# Altium schematic sheet Menu-Control-Motor.SchDoc
size A4; SheetNumber: 1; SheetTotal: 2
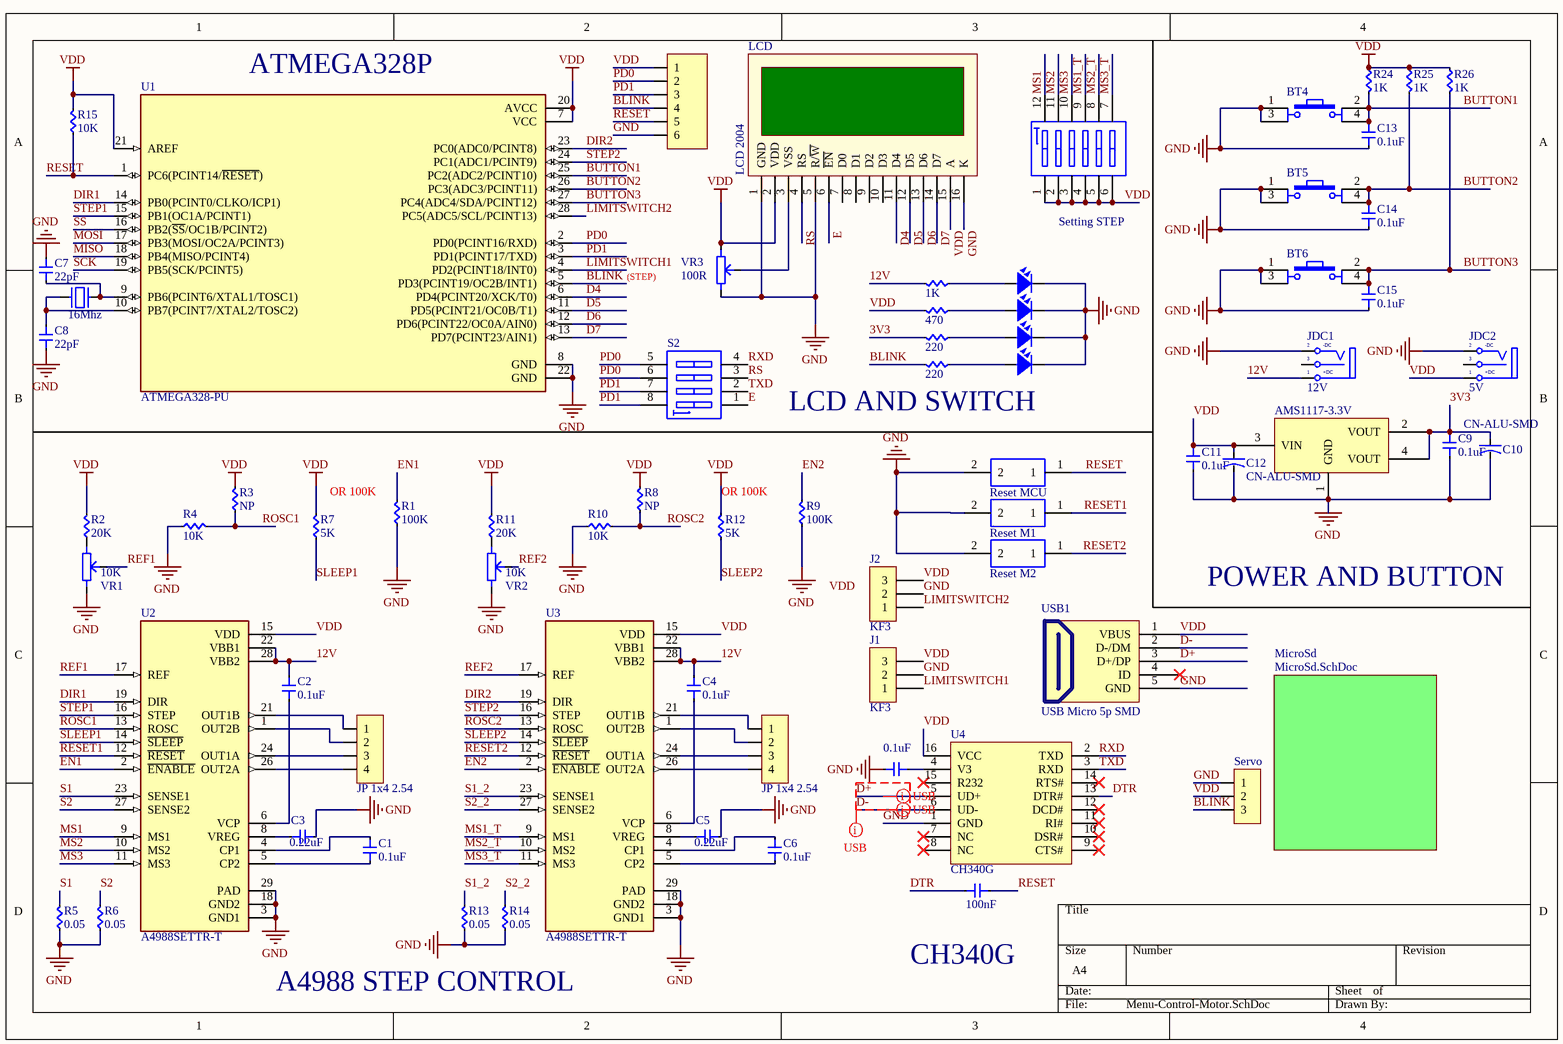
[diagram p0: Menu-Control-Motor.SchDoc]

## Parts
AMS1117-3.3V  AMS1117-3.3V  [SOT223]  (value not drawn)
BT4  Button 4p  [SMD button 4 pins 6x6]  (value not drawn)
BT5  Button 4p  [SMD button 4 pins 6x6]  (value not drawn)
BT6  Button 4p  [SMD button 4 pins 6x6]  (value not drawn)
C1  0.1uF  [Cap 0805]
C2  0.1uF  [Cap 0805]
C3  0.22uF  [Cap 0805]
C4  0.1uF  [Cap 0805]
C5  0.22uF  [Cap 0805]
C6  0.1uF  [Cap 0805]
C7  22pF  [Cap 0805]
C8  22pF  [Cap 0805]
C9  0.1uF  [Cap 0805]
C10  CN-ALU-SMD  [CAP-ALU-SMD-6.3x7.7x2.2]
C11  0.1uF  [Cap 0805]
C12  CN-ALU-SMD  [CAP-ALU-SMD-6.3x7.7x2.2]
C13  0.1uF  [Cap 0805]
C14  0.1uF  [Cap 0805]
C15  0.1uF  [Cap 0805]
C16  0.1uF  [Cap 0805]
C17  100nF  [Cap 0805]
DEBUG  CHECK  [JP 1x6 DT]  (value not drawn)
J1  KF3  [KF3-5.08]
J2  KF3  [KF3-5.08]
JDC1  12V  [DC0]
JDC2  5V  [DC0]
JP2  JP 1x4 2.54  [JP 1x4 DT]
JP3  JP 1x4 2.54  [JP 1x4 DT]
LCD  LCD 2004  [LCD_LCD-20X4B]
LED1  LED  [LED-0805-Blue]  (value not drawn)
LED2  LED  [LED-0805-Blue]  (value not drawn)
LED3  LED  [LED-0805-Blue]  (value not drawn)
LED4  LED  [LED-0805-Blue]  (value not drawn)
R1  100K  [RES 0805]
R2  20K  [RES 0805]
R3  NP  [RES 0805]
R4  10K  [RES 0805]
R5  0.05  [RES 0805]
R6  0.05  [RES 0805]
R7  5K  [RES 0805]
R8  NP  [RES 0805]
R9  100K  [RES 0805]
R10  10K  [RES 0805]
R11  20K  [RES 0805]
R12  5K  [RES 0805]
R13  0.05  [RES 0805]
R14  0.05  [RES 0805]
R15  10K  [RES 0805]
R16  1K  [RES 0805]
R17  470  [RES 0805]
R21  220  [RES 0805]
R24  1K  [RES 0805]
R25  1K  [RES 0805]
R26  1K  [RES 0805]
R27  220  [RES 0805]
Reset_M1  Component_1  [PCBComponent_1]  (value not drawn)
Reset_M2  Component_1  [PCBComponent_1]  (value not drawn)
Reset_MCU  Component_1  [PCBComponent_1]  (value not drawn)
S2  (no value)  [SW-DIP4]
Servo  JP 1x3 2.54  [JP 1x3 DT]  (value not drawn)
Setting_STEP  (no value)  [SW-DIP6]
U1  ATMEGA328-PU  [DIP787W46P254L3467H508Q28]
U2  A4988SETTR-T  [QFN50P500X500X90-29N]
U3  A4988SETTR-T  [QFN50P500X500X90-29N]
U4  CH340G  [SOIC16_50_284_25X90_SMT]
USB1  USB Micro 5p SMD  [USB Micro 5p SMD]
VR1  10K  [Bien Tro Tam Giac Dung]
VR2  10K  [Bien Tro Tam Giac Dung]
VR3  100R  [Bien Tro Tam Giac Dung]
Y1  16Mhz  [Thach Anh 2 chan cam]

## Sub-sheets
MicroSd = MicroSd.SchDoc: no entries

## Nets
GND: AMS1117-3.3V.1(GND) BT4.1 BT4.3 BT5.1 BT5.3 BT6.1 BT6.3 C3.2 C5.2 C7.2 C8.1 C9.2 C10.2 C11.2 C12.2 C13.2 C14.2 C15.2 C16.1 DEBUG.6 J1.2 J2.2 JDC1.2(TN) JDC2.2(TN) LCD.1(GND) LCD.5(R/~{W}) LCD.16(K) LED1.2 LED2.2 LED3.2 LED4.2 R1.1 R4.1 R5.1 R6.1 R9.1 R10.1 R13.1 R14.1 Reset_M1.2 Reset_M2.2 Reset_MCU.2 Servo.1 U1.8(GND) U1.22(GND) U2.3(GND1) U2.18(GND2) U2.29(PAD) U3.3(GND1) U3.18(GND2) U3.29(PAD) U4.1(GND) USB1.5(GND) VR1.3 VR2.3 VR3.3
VDD: AMS1117-3.3V.3(VIN) C11.1 C12.1 DEBUG.1 J1.3 J2.3 JDC2.1(T) LCD.2(VDD) LCD.15(A) R2.2 R3.2 R7.2 R8.2 R11.2 R12.2 R15.2 R17.2 R24.1 R25.1 R26.1 Servo.2 Setting_STEP.1 Setting_STEP.2 Setting_STEP.3 Setting_STEP.4 Setting_STEP.5 Setting_STEP.6 U1.7(VCC) U1.20(AVCC) U1.21(AREF) U2.15(VDD) U3.15(VDD) U4.16(VCC) USB1.1(VBUS) VR3.1
3V3: AMS1117-3.3V.2(VOUT) AMS1117-3.3V.4(VOUT) C9.1 C10.1 R21.2
12V: C2.1 C4.1 JDC1.1(T) R16.2 U2.22(VBB1) U2.28(VBB2) U3.22(VBB1) U3.28(VBB2)
BLINK: DEBUG.4 R27.2 Servo.3 U1.5(PD3(PCINT19/OC2B/INT1))
BUTTON1: BT4.2 BT4.4 C13.1 R24.2 U1.25(PC2(ADC2/PCINT10))
BUTTON2: BT5.2 BT5.4 C14.1 R25.2 U1.26(PC3(ADC3/PCINT11))
BUTTON3: BT6.2 BT6.4 C15.1 R26.2 U1.27(PC4(ADC4/SDA/PCINT12))
D4: LCD.11(D4) U1.6(PD4(PCINT20/XCK/T0))
D5: LCD.12(D5) U1.11(PD5(PCINT21/OC0B/T1))
D6: LCD.13(D6) U1.12(PD6(PCINT22/OC0A/AIN0))
D7: LCD.14(D7) U1.13(PD7(PCINT23/AIN1))
D+: U4.5(UD+) USB1.3(D+/DP)
D-: U4.6(UD-) USB1.2(D-/DM)
DIR1: U1.14(PB0(PCINT0/CLKO/ICP1)) U2.19(DIR)
DIR2: U1.23(PC0(ADC0/PCINT8)) U3.19(DIR)
DTR: C17.1 U4.13(DTR#)
E: LCD.6(~{EN}) S2.1
EN1: R1.2 U2.2(~{ENABLE})
EN2: R9.2 U3.2(~{ENABLE})
LIMITSWITCH1: J1.1 U1.4(PD2(PCINT18/INT0))
LIMITSWITCH2: J2.1 U1.28(PC5(ADC5/SCL/PCINT13))
MISO: U1.18(PB4(MISO/PCINT4))
MOSI: U1.17(PB3(MOSI/OC2A/PCINT3))
MS1: Setting_STEP.12 U2.9(MS1)
MS1_T: Setting_STEP.9 U3.9(MS1)
MS2: Setting_STEP.11 U2.10(MS2)
MS2_T: Setting_STEP.8 U3.10(MS2)
MS3: Setting_STEP.10 U2.11(MS3)
MS3_T: Setting_STEP.7 U3.11(MS3)
PD0: DEBUG.2 S2.5 S2.6 U1.2(PD0(PCINT16/RXD))
PD1: DEBUG.3 S2.7 S2.8 U1.3(PD1(PCINT17/TXD))
REF1: U2.17(REF) VR1.2
REF2: U3.17(REF) VR2.2
RESET: C17.2 DEBUG.5 R15.1 Reset_MCU.1 U1.1(PC6(PCINT14/~{RESET}))
RESET1: Reset_M1.1 U2.12(~{RESET})
RESET2: Reset_M2.1 U3.12(~{RESET})
ROSC1: R3.1 R4.2 U2.13(ROSC)
ROSC2: R8.1 R10.2 U3.13(ROSC)
RS: LCD.4(RS) S2.3
RXD: S2.4 U4.2(TXD)
S1: R5.2 U2.23(SENSE1)
S1_2: R13.2 U3.23(SENSE1)
S2: R6.2 U2.27(SENSE2)
S2_2: R14.2 U3.27(SENSE2)
SCK: U1.19(PB5(SCK/PCINT5))
SLEEP1: R7.1 U2.14(~{SLEEP})
SLEEP2: R12.1 U3.14(~{SLEEP})
SS: U1.16(PB2(~{SS}/OC1B/PCINT2))
STEP1: U1.15(PB1(OC1A/PCINT1)) U2.16(STEP)
STEP2: U1.24(PC1(ADC1/PCINT9)) U3.16(STEP)
TXD: S2.2 U4.3(RXD)
NetC1_1: C1.1 U2.4(CP1)
NetC1_2: C1.2 U2.5(CP2)
NetC2_2: C2.2 U2.6(VCP)
NetC3_1: C3.1 U2.8(VREG)
NetC4_2: C4.2 U3.6(VCP)
NetC5_1: C5.1 U3.8(VREG)
NetC6_1: C6.1 U3.4(CP1)
NetC6_2: C6.2 U3.5(CP2)
NetC7_1: C7.1 U1.9(PB6(PCINT6/XTAL1/TOSC1)) Y1.2
NetC8_2: C8.2 U1.10(PB7(PCINT7/XTAL2/TOSC2)) Y1.1
NetC16_2: C16.2 U4.4(V3)
NetJP2_1: JP2.1 U2.21(OUT1B)
NetJP2_2: JP2.2 U2.1(OUT2B)
NetJP2_3: JP2.3 U2.24(OUT1A)
NetJP2_4: JP2.4 U2.26(OUT2A)
NetJP3_1: JP3.1 U3.21(OUT1B)
NetJP3_2: JP3.2 U3.1(OUT2B)
NetJP3_3: JP3.3 U3.24(OUT1A)
NetJP3_4: JP3.4 U3.26(OUT2A)
NetLCD_3: LCD.3(VSS) VR3.2
NetLED1_1: LED1.1 R16.1
NetLED2_1: LED2.1 R17.1
NetLED3_1: LED3.1 R21.1
NetLED4_1: LED4.1 R27.1
NetR2_1: R2.1 VR1.1
NetR11_1: R11.1 VR2.1

Not connected (* = marked no-connect by the designer): JDC1 3(S); JDC2 3(S); LCD 7(D0) 8(D1) 9(D2) 10(D3); U4 7(NC)* 8(NC)* 9(CTS#)* 10(DSR#)* 11(RI#)* 12(DCD#)* 14(RTS#)* 15(R232)*; USB1 4(ID)*

## Layout directives
differential pair: D+, D-
mark named USB: D-

## Notes on the sheet
- (near U1) ATMEGA328P
- (STEP)
- LCD AND SWITCH
- OR 100K
- (near R12) OR 100K
- POWER AND BUTTON
- A4988 STEP CONTROL
- (near C17) CH340G
- Labels drawn without touching a wire or pin: VDD
- (in symbol DCIN) -DC; +DC

## Library data of the parts
AMS1117-3.3V = AMS1117 SMD: Dán; Value: AMS1117-3.3V SOT223; Don_Vi: Con; Ma_Hang: MH000596; Ghi_Chu: *; Kieu_Chan: *; Chung_Loai: Dán
BT4-BT6 = Button 4p: Ten: Nút Nhấn 4 Chân 6.2x6.2x3.1MM SMD; Ma_Hang: MH002424
C1-C9 C11 C13-C17 = Cap 0805: Capacitor SMD 0805
C10 C12 = CN-ALU-SMD: Polarized Capacitor (Axial); Published: 8-Jun-2000; LatestRevisionDate: 17-Jul-2002; LatestRevisionNote: Re-released for DXP Platform.; PackageReference: POLAR0.8; Publisher: Altium Limited
DEBUG = JP 1x6 2.54 Duc Thang: Cắm; Ten_Linh_Kien: Jump Đơn Đực 2.54MM 1x40P Thẳng 11MM; Don_Vi: Con; Ma_Hang: MH000903; Ghi_Chu: *; Kieu_Chan: *; Chung_Loai: Cắm
J1 J2 = KF3: Manufacturer: Würth Elektronik eiSos GmbH; partNo: 691103110003; ComponentLink1 Description: Manufacturer; ComponentLink2 Description: Datasheet; NoPins: 3; Created Date: 29 October 2013; ComponentLink1URL: http://www.we-online.com; ComponentLink2URL: http://katalog.we-online.de/em/datasheet/6911031100xx.pdf; Created by: Karrer Zheng
JDC1 JDC2 = DCIN: Jac DC input; Value: Jac DC
JP2 JP3 = JP 1x4 2.54 Duc Thang: Cắm; Ten_Linh_Kien: Jump Đơn Đực 2.54MM 1x40P Thẳng 11MM; Don_Vi: Con; Ma_Hang: MH000903; Ghi_Chu: *; Kieu_Chan: *; Chung_Loai: Cắm
LCD = LCD 2004 5V: LCD 2004 5V Xanh Dương; Ten: LCD 2004 Xanh Dương; Ma_Hang: WVEZ; CHIP: HD44780; Don Vi Mua: Nshop
LED1-LED4 = LED SMD: Value: LED 3 - 5 ly 2 Colour
R1-R3 R5-R9 R11-R14 R16 R17 R21 R24-R27 = RES 0805: RES SMD 0805; Manufacturer: Vishay Dale; Manufacturer Part Number: CRCW040210K0FKED; Resistance (Ohms): 10k; Tolerance: ±1%; Power (Watts): 0.063W, 1/16W; Temperature Coefficient: ±100ppm/°C; Supplier 1: Digi-Key; RoHS: RoHS Compliant; Category: Resistors; Stock 1: 2392462; Pricing 1: 10=0.083, 50=0.0444, 200=0.0255, 1000=0.0174 (USD); Packaging: Cut Tape (CT); Composition: Thick Film; Features: Automotive AEC-Q200; Operating Temperature: -55°C ~ 155°C; Package / Case: 0402 (1005 Metric); Supplier Device Package: 0402 (1005 Metric); Size / Dimension: 0.039" L x 0.020" W (1.00mm x 0.50mm); Height: 0.016" (0.40mm); Number of Terminations: 2; ComponentLink1URL: http://www.vishay.com/docs/20035/dcrcwe3.pdf; ComponentLink1Description: http://www.vishay.com/docs/20035/dcrcwe3.pdf; Supplier Part Number 1: 541-10.0KLCT-ND
R4 R10 R15 = RES 0805: RES SMD 0805; Manufacturer: Vishay Dale; Manufacturer Part Number: CRCW040210K0FKED; Tolerance: ±1%; Power (Watts): 0.063W, 1/16W; Temperature Coefficient: ±100ppm/°C; Supplier 1: Digi-Key; RoHS: RoHS Compliant; Category: Resistors; Stock 1: 2392462; Pricing 1: 10=0.083, 50=0.0444, 200=0.0255, 1000=0.0174 (USD); Packaging: Cut Tape (CT); Resistance (Ohms): 10k; Composition: Thick Film; Features: Automotive AEC-Q200; Operating Temperature: -55°C ~ 155°C; Package / Case: 0402 (1005 Metric); Supplier Device Package: 0402 (1005 Metric); Size / Dimension: 0.039" L x 0.020" W (1.00mm x 0.50mm); Height: 0.016" (0.40mm); Number of Terminations: 2; ComponentLink1URL: http://www.vishay.com/docs/20035/dcrcwe3.pdf; ComponentLink1Description: http://www.vishay.com/docs/20035/dcrcwe3.pdf; Supplier Part Number 1: 541-10.0KLCT-ND
S2 = SWDIP4: WS-DITV 2.54 mm small compact THT flat actuator with top tape; Manufacturer: Wurth Elektronik; Part No.: 418127160904; ComponentLink1 Description: Manufacturer; ComponentLink2 Description: Datasheet; Pole: 04; Created Date: Dec.2015; ComponentLink1URL: http://www.we-online.com; ComponentLink2URL: http://katalog.we-online.de/em/datasheet/4181271609xx.pdf; Created by: Baojun Chen
Servo = JP 1x3 2.54 Duc Thang: Cắm; Ten_Linh_Kien: Jump Đơn Đực 2.54MM 1x40P Thẳng 11MM; Don_Vi: Con; Ma_Hang: MH000903; Ghi_Chu: *; Kieu_Chan: *; Chung_Loai: Cắm
Setting_STEP = SWDIP6: WS-DITV 2.54 mm small compact THT flat actuator with top tape; Manufacturer: Wurth Elektronik; Part No.: 418127160906; ComponentLink1 Description: Manufacturer; ComponentLink2 Description: Datasheet; Pole: 06; Created Date: Dec.2015; ComponentLink1URL: http://www.we-online.com; ComponentLink2URL: http://katalog.we-online.de/em/datasheet/4181271609xx.pdf; Created by: Baojun Chen
U1 = ATMEGA328-PU: AVR AVRÂ® ATmega Microcontroller IC 8-Bit 20MHz 32KB (16K x 16) FLASH 28-PDIP; MF: Microchip; Availability: In Stock; MP: ATMEGA328-PU; SnapEDA_Link: https://www.snapeda.com/parts/ATMEGA328-PU/Microchip/view-part/?ref=snap; Value: *; Price: None; Purchase-URL: https://pricing.snapeda.com/search/part/ATMEGA328-PU/?ref=eda; Check_prices: https://www.snapeda.com/parts/ATMEGA328-PU/Microchip/view-part/?ref=eda; Package: DIP-28 Microchip Technology
U2 U3 = A4988SETTR-T: Bipolar Motor Driver DMOS Logic 28-QFN (5x5); MF: Allegro; Check_prices: https://www.snapeda.com/parts/A4988SETTR-T/Allegro%20Industries/view-part/46276/?ref=eda; Value: *; Purchase-URL: https://pricing.snapeda.com/search/part/A4988SETTR-T/?ref=eda; Digi-Key_Part_Number: 620-1343-1-ND; SnapEDA_Link: https://www.snapeda.com/parts/A4988SETTR-T/Allegro%20Industries/view-part/46276/?ref=snap; MP: A4988SETTR-T; Package: QFN-28 Allegro MicroSystems LLC
U4 = CH340C: USB Bridge, USB to UART USB 2.0 UART Interface; Manufacturer: Olimex; Alternate Part Number-1: NA; Manufacturer Part Number: CH340C; Case/Package: SOIC16; Supplier-1: LCSC; Supplier Part Number-1: C84681
USB1 = USB Micro 5p SMD: USB Type B; Ten: MicroUSB MK5P SMD; Ma_Hang: MH001020
VR1 VR2 = Bien tro tam giac 10K Dung: Cắm; Ma_Hang: MH000919; Don_Vi: Con; Ten_Linh_Kien: Biến Trở Tam Giác 103-10K RM065 (Chân Đứng); Chung_Loai: Cắm; Kieu_Chan: *
VR3 = Bien tro tam giac 100R Dung: Cắm; Ten_Linh_Kien: Biến Trở Tam Giác 101-100R RM065; Don_Vi: Con; Ma_Hang: MH003710; Ghi_Chu: *; Kieu_Chan: *; Chung_Loai: Cắm
Y1 = Thach Anh 2 chan Cam: Crystal For all Crystal 2pin.; Value: 4Mhz